# EAGLE design Envelope 1.0 (EAGLE 7.2.0)
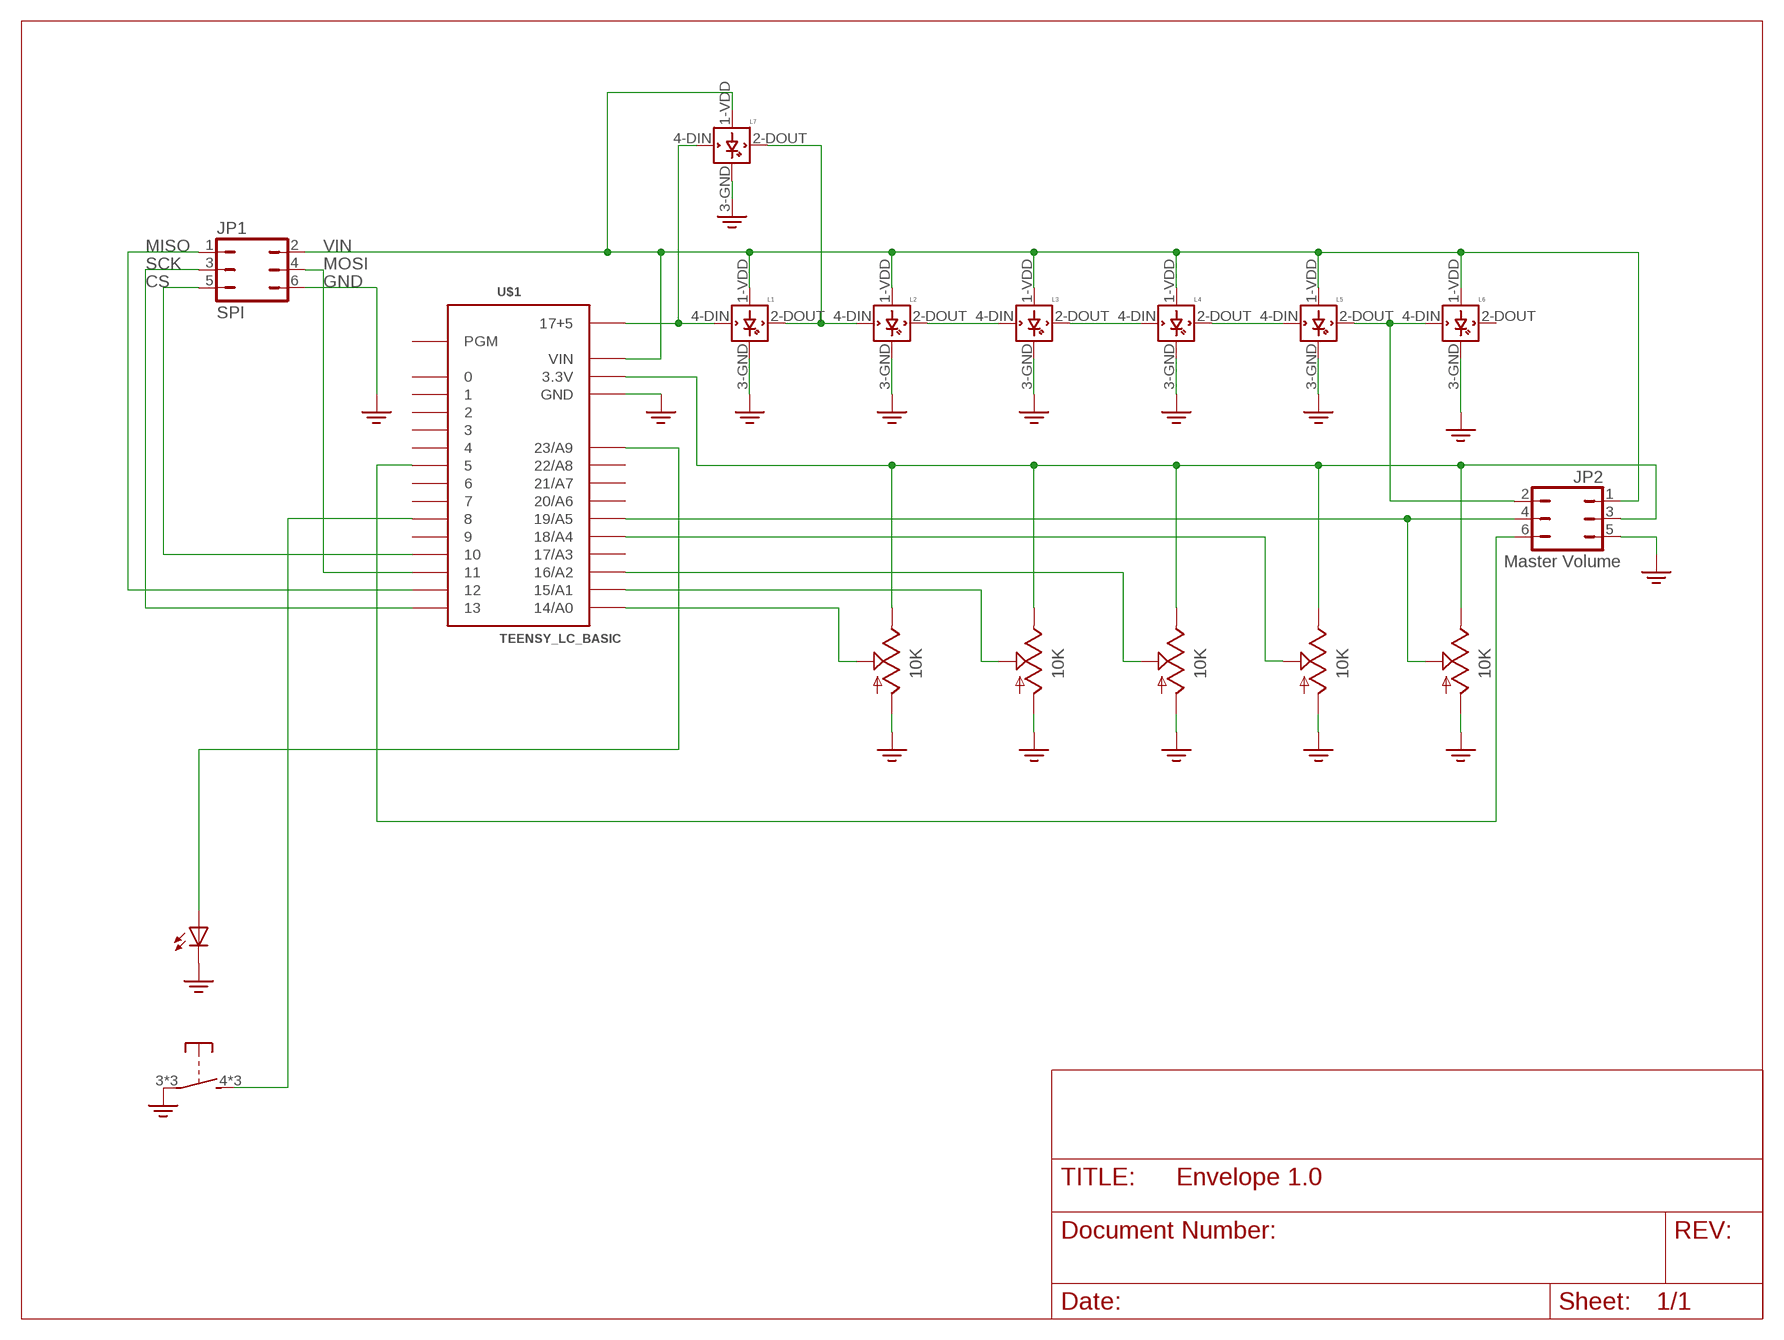
[diagram p0: schematic, sheet 1]

## Parts
JP1  SPI  JP3Q  [JP3Q]
JP2  Master Volume  JP3Q  [JP3Q]
L1  WS2812B  [WS2812B]
L2  WS2812B  [WS2812B]
L3  WS2812B  [WS2812B]
L4  WS2812B  [WS2812B]
L5  WS2812B  [WS2812B]
L6  WS2812B  [WS2812B]
L7  WS2812B  [WS2812B]
U$1  TEENSY_LC_BASIC  [TEENSY_LC_BASIC]
U$2  10K  ALPHA1400F10K  [14MMPOT]
U$3  10K  ALPHA1400F10K  [14MMPOT]
U$4  10K  ALPHA1400F10K  [14MMPOT]
U$5  10K  ALPHA1400F10K  [14MMPOT]
U$6  10K  ALPHA1400F10K  [14MMPOT]
U$7  TL1220MEZZ  [MEZZ]

## Nets
3.3V: JP2.3 U$1.3.3V1(3.3V) U$2.P$4(E) U$3.P$4(E) U$4.P$4(E) U$5.P$4(E) U$6.P$4(E)
GND: JP1.6 JP2.5 L1.3-GND(GND) L2.3-GND(GND) L3.3-GND(GND) L4.3-GND(GND) L5.3-GND(GND) L6.3-GND(GND) L7.3-GND(GND) U$1.GND U$1.GND1(GND) U$1.GND2(GND) U$2.P$5(A) U$3.P$5(A) U$4.P$5(A) U$5.P$5(A) U$6.P$5(A) U$7.2(C) U$7.3(P) U$7.P$1(P) U$7.P$2(P) U$7.P$6(C) ; supply symbol labelled GND2
N$1: L1.4-DIN(DIN) L7.4-DIN(DIN) U$1.17+5
N$2: L1.2-DOUT(DOUT) L2.4-DIN(DIN) L7.2-DOUT(DOUT)
N$3: L2.2-DOUT(DOUT) L3.4-DIN(DIN)
N$4: L3.2-DOUT(DOUT) L4.4-DIN(DIN)
N$5: L4.2-DOUT(DOUT) L5.4-DIN(DIN)
N$6: U$1.23/A9 U$7.1(A) U$7.P$5(A)
N$7: U$1.14/A0 U$2.P$3(S)
N$8: U$1.15/A1 U$3.P$3(S)
N$9: U$1.16/A2 U$4.P$3(S)
N$10: U$1.18/A4 U$5.P$3(S)
N$11: U$1.8 U$7.4(S) U$7.P$3(S) U$7.P$4(S)
N$12: JP2.6 U$1.5
N$21: JP1.1 U$1.12
N$23: JP1.3 U$1.13
N$24: JP1.5 U$1.10
N$26: JP2.2 L5.2-DOUT(DOUT) L6.4-DIN(DIN)
N$27: JP2.4 U$1.19/A5 U$6.P$3(S)
N$28: JP1.4 U$1.11
VIN: JP1.2 JP2.1 L1.1-VDD(VDD) L2.1-VDD(VDD) L3.1-VDD(VDD) L4.1-VDD(VDD) L5.1-VDD(VDD) L6.1-VDD(VDD) L7.1-VDD(VDD) U$1.VIN
Unconnected: L6.2-DOUT(DOUT) U$1.0 U$1.1 U$1.2 U$1.3 U$1.4 U$1.6 U$1.7 U$1.9 U$1.17/A3 U$1.20/A6 U$1.21/A7 U$1.22/A8 U$1.PGM

## Notes on the sheet
- MISO | VIN
- SCK | MOSI
- CS | GND

## Library data of the parts
JP1 = jumper:JP3Q: JUMPER
JP2 = SynthLib:JP3Q: JUMPER
L1-L7 = SynthLib:WS2812B
U$1 = SynthLib:TEENSY_LC_BASIC: Basic Teensy LC with none of the 'inner' pins enabled. See '+4', 'AllAnalogPins", and 'AllPins' packages for additional pin holes, as needed.
U$2-U$6 = SynthLib:ALPHA1400F: Alpha 1400F series clear shaft potentiometer
U$7 = SynthLib:TL1220MEZZ

## Board
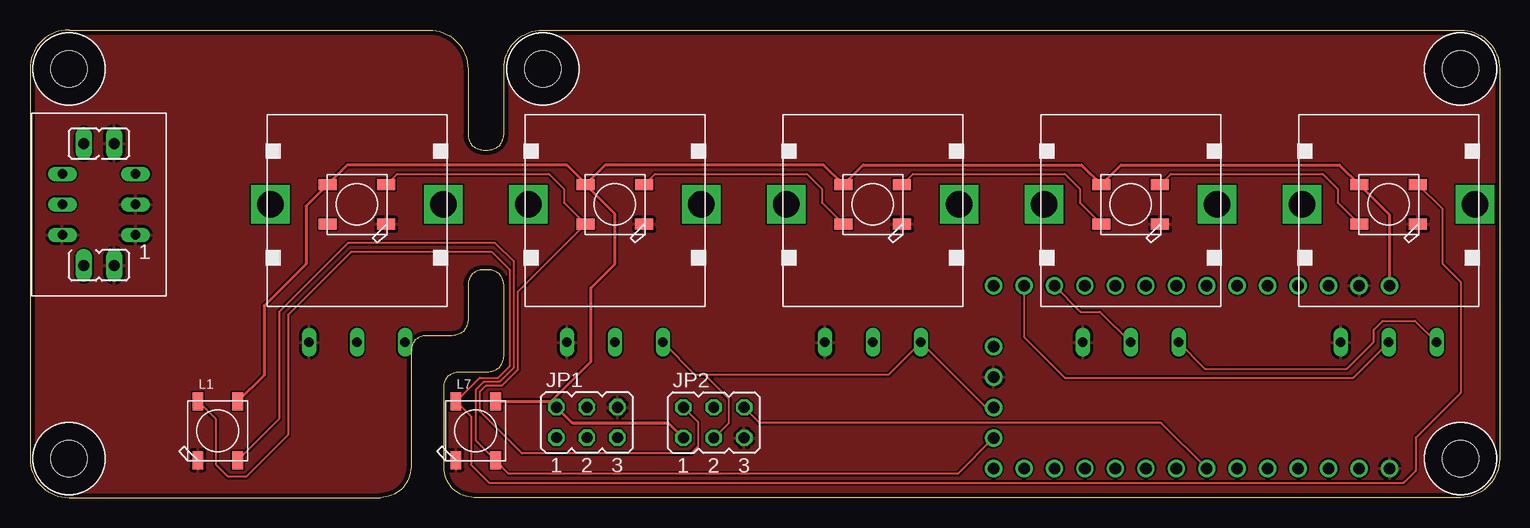
[diagram p1: board, top side]
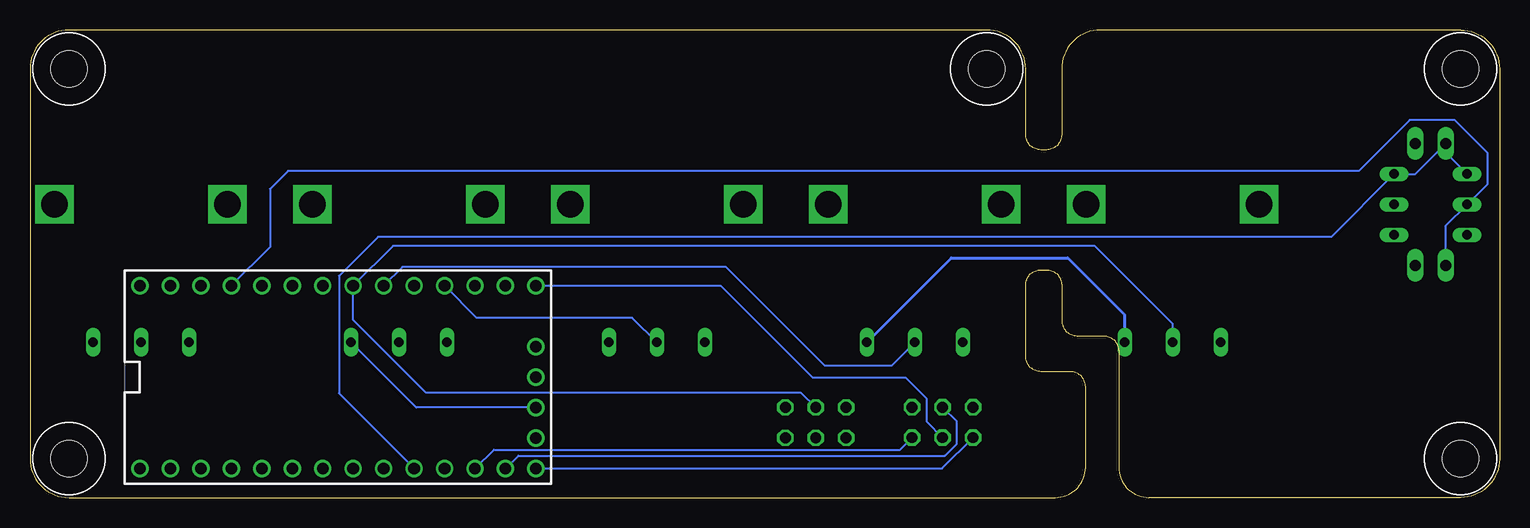
[diagram p2: board, bottom side, seen from below]

Size 122.5 x 39 mm. Coordinates in mm from the lower left corner, seen from the top.
Outline: 0,35.75 0,3.25 arc90 3.25,0 29.21,0 arc90 31.75,2.54 31.75,12.23 arc-90 33.02,13.5 35.23,13.5 arc90 36.5,14.77 36.5,17.73 arc-90 37.77,19 38.23,19 arc-90 39.5,17.73 39.5,11.77 arc-90 38.23,10.5 35.77,10.5 arc90 34.5,9.23 34.5,2.54 arc90 37.04,0 119.25,0 arc90 122.5,3.25 122.5,35.75 arc90 119.25,39 42.75,39 arc90 39.5,35.75 39.5,30.27 arc-90 38.23,29 37.77,29 arc-90 36.5,30.27 36.5,35.75 arc90 33.25,39 3.25,39 arc90 0,35.75
Copper layers (1*16): Top 0.0356mm / dielectric 1.5011mm / Bottom 0.0356mm
Design rules "LaenPCBOrder *": minimum track width 6mil, minimum drill 13mil, track to track 6mil, track to pad 6mil, pad to pad 6mil, via to via 6mil, smd to smd 6mil, copper to edge 15mil, drill to drill 6mil, minimum pad ring 7mil, minimum via ring 7mil, stop-mask expansion 3mil, vias tented up to drill 0mil, thermal gap 10mil

### Footprints (pad centres in the part's own frame; a part is rotated, then mirrored left to right if it is on the bottom)
JP3Q = drill 0.914 octagon: 1 -2.54,-1.27; 2 -2.54,1.27; 3 0,-1.27; 4 0,1.27; 5 2.54,-1.27; 6 2.54,1.27
WS2812B = smd 1.5 x 0.9: 1-VDD 2.45,-1.65; 2-DOUT 2.45,1.65; 3-GND -2.45,1.65; 4-DIN -2.45,-1.65
TEENSY_LC_BASIC = drill 0.965: 0 -7.62,13.97; 1 -7.62,11.43; 2 -7.62,8.89; 3 -7.62,6.35; 3.3V 7.62,11.43; 3.3V1 -2.54,-16.51; 4 -7.62,3.81; 5 -7.62,1.27; 6 -7.62,-1.27; 7 -7.62,-3.81; 8 -7.62,-6.35; 9 -7.62,-8.89; 10 -7.62,-11.43; 11 -7.62,-13.97; 12 -7.62,-16.51; 13 7.62,-16.51; 14/A0 7.62,-13.97; 15/A1 7.62,-11.43; 16/A2 7.62,-8.89; 17+5 -5.08,-16.51; 17/A3 7.62,-6.35; 18/A4 7.62,-3.81; 19/A5 7.62,-1.27; 20/A6 7.62,1.27; 21/A7 7.62,3.81; 22/A8 7.62,6.35; 23/A9 7.62,8.89; GND -7.62,16.51; GND1 0,-16.51; GND2 7.62,13.97; PGM 2.54,-16.51; VIN 7.62,16.51
14MMPOT = drill 2.2 square: P$1 -7.2,0; P$2 7.2,0 | drill 0.8 long: P$3 0,-11.5; P$4 4,-11.5; P$5 -4,-11.5
MEZZ = drill 0.914 long: 1 -5.08,1.27; 2 -5.08,-1.27; 3 5.08,-1.27; 4 5.08,1.27 | drill 0.8 long: P$1 -2.54,-3.048; P$2 -2.54,3.048; P$3 2.54,-3.048; P$4 2.54,3.048; P$5 0,3.048; P$6 0,-3.048
STANDOFF-M3 = hole 3: 0,0

### Placement (x,y rotation side)
JP1  46.43,6.27 0 top
JP2  57,6.25 0 top
L1  15.65,5.56 90 top
L2  113.25,24.45 180 top
L3  91.75,24.45 180 top
L4  70.25,24.45 180 top
L5  48.75,24.45 180 top
L6  27.25,24.45 180 top
L7  37.15,5.56 90 top
U$1  96.83,10.05 90 bottom
U$2  113.25,24.45 0 top
U$3  91.75,24.45 0 top
U$4  70.25,24.45 0 top
U$5  48.75,24.45 0 top
U$6  27.25,24.45 0 top
U$7  5.75,24.45 90 top
U$8  [STANDOFF-M3]  3.25,3.25 0 top
U$9  [STANDOFF-M3]  119.25,35.75 0 top
U$10  [STANDOFF-M3]  42.75,35.75 0 top
U$11  [STANDOFF-M3]  119.25,3.25 0 top
U$12  [STANDOFF-M3]  3.25,35.75 0 top

### Tracks (layer width: path | path; a pad name or v marks a point on that pad's centre or on a via)
3.3V
  Top 0.16: U$1.3.3V1 79.69,7.51 U$4.P$4 71.55,10.25 56.25,10.25 | U$3.P$4 97.95,10.75 109.75,10.75 112,13 112,14 112.75,14.75 115.45,14.75 U$2.P$4 | 56.25,10.25 55.45,10.25 U$5.P$4 | JP2.3 58.25,6.23 58.25,8.25 56.25,10.25
  Bottom 0.16: U$1.3.3V1 90.31,7.51 U$3.P$4
  Bottom 0.254: U$5.P$4 45.7,20 36,20 31.25,15.25 U$6.P$4
GND
  pour Top: -6,44.5 125,44.5 125,-1 -6,-1
N$1
  Top 0.16: U$1.17+5 77.35,2 39.91,2 L7.4-DIN 37.17,4.74 37.17,9 37.83,9.67 39.17,9.67 40.33,10.83 40.33,19.67 38.75,21.25 26.5,21.25 20.75,15.5 20.75,6.56 L1.4-DIN
N$2
  Top 0.16: L1.2-DOUT 15.5,6.51 15.5,2.75 16.5,1.75 18,1.75 21.5,5.25 21.5,15.25 26.75,20.5 38.5,20.5 40,19 40,11 39,10 37.49,10 L7.2-DOUT 36.75,6.76 36.75,2.75 38.25,1.25 114.5,1.25 115.5,2.25 115.5,5 119.25,8.75 119.25,18 117.75,19.5 117.75,24.05 L2.4-DIN
N$3
  Top 0.16: L3.4-DIN 95.1,27 107.75,27 109,25.75 109,24.6 L2.2-DOUT
N$4
  Top 0.16: L4.4-DIN 73.6,27 86.25,27 87.5,25.75 87.5,24.6 L3.2-DOUT
N$5
  Top 0.16: L5.4-DIN 52.1,27 64.75,27 66,25.75 66,24.6 L4.2-DOUT
N$6
  Bottom 0.16: U$1.23/A9 102.5,20.89 102.5,25.75 101,27.25 11.75,27.25 7.5,31.5 3.75,31.5 1,28.75 1,26.15 U$7.P$5 4.48,22.67 U$7.1
N$7
  Top 0.16: U$1.14/A0 82.86,13.39 86.25,10 110.3,10 U$2.P$3
N$8
  Top 0.16: U$1.15/A1 87.57,15.5 89.2,15.5 U$3.P$3
N$9
  Bottom 0.16: U$4.P$3 72.3,15 85.27,15 U$1.16/A2
N$10
  Bottom 0.16: U$5.P$3 50.7,11 56.25,11 64.5,19.25 91.44,19.25 U$1.18/A4
N$11
  Bottom 0.16: U$1.8 96.75,8.7 96.75,18.5 93.5,21.75 14.04,21.75 U$7.P$3 7.02,26.99 U$7.4 4.48,28.77 U$7.P$4
N$12
  Top 0.16: U$1.5 94.28,6.25 60.81,6.25 JP2.6
N$21
  Bottom 0.16: U$1.12 46.46,2.43 JP1.1
N$23
  Bottom 0.16: JP1.3 47.75,6.32 47.75,8.25 49.5,10 57.25,10 62.88,15.62 63.25,16 64.92,17.67 U$1.13
N$24
  Bottom 0.16: U$1.10 83.83,4 49.97,4 JP1.5
N$26
  Top 0.16: L6.4-DIN 30.6,27 43.25,27 44.5,25.75 44.5,24.6 L5.2-DOUT 40.67,17.17 40.67,10.67 39.33,9.33 38,9.33 37.5,8.83 37.5,7.17 41,3.67 55.08,3.67 55.67,4.25 55.67,6.31 JP2.2
N$27
  Bottom 0.16: U$6.P$3 27.25,14.5 33.75,21 92.23,21 U$1.19/A5 95.56,14.81 89.5,8.75 58.23,8.75 JP2.4
N$28
  Bottom 0.16: U$1.11 81.79,3.5 46.25,3.5 45.25,4.5 45.25,6.36 JP1.4
VIN
  Top 0.254: L1.1-VDD 19.5,10.21 19.5,16 23,19.5 23,24.3 L6.1-VDD 26.45,27.75 44.75,27.75 46.3,26.2 L5.1-VDD | L5.1-VDD 47.95,27.75 66.15,27.75 L4.1-VDD 69.45,27.75 87.65,27.75 L3.1-VDD 90.95,27.75 109.15,27.75 L2.1-VDD 113.34,23.56 U$1.VIN | JP2.1 53.19,6.25 45.18,6.25 JP1.2 43.42,8.01 | L7.1-VDD 43.42,8.01 | 43.42,8.01 46.75,11.34 46.75,17.5 48.75,19.5 48.75,23.65 L5.1-VDD